# EAGLE schematic Circuit (EAGLE 7.5.0)
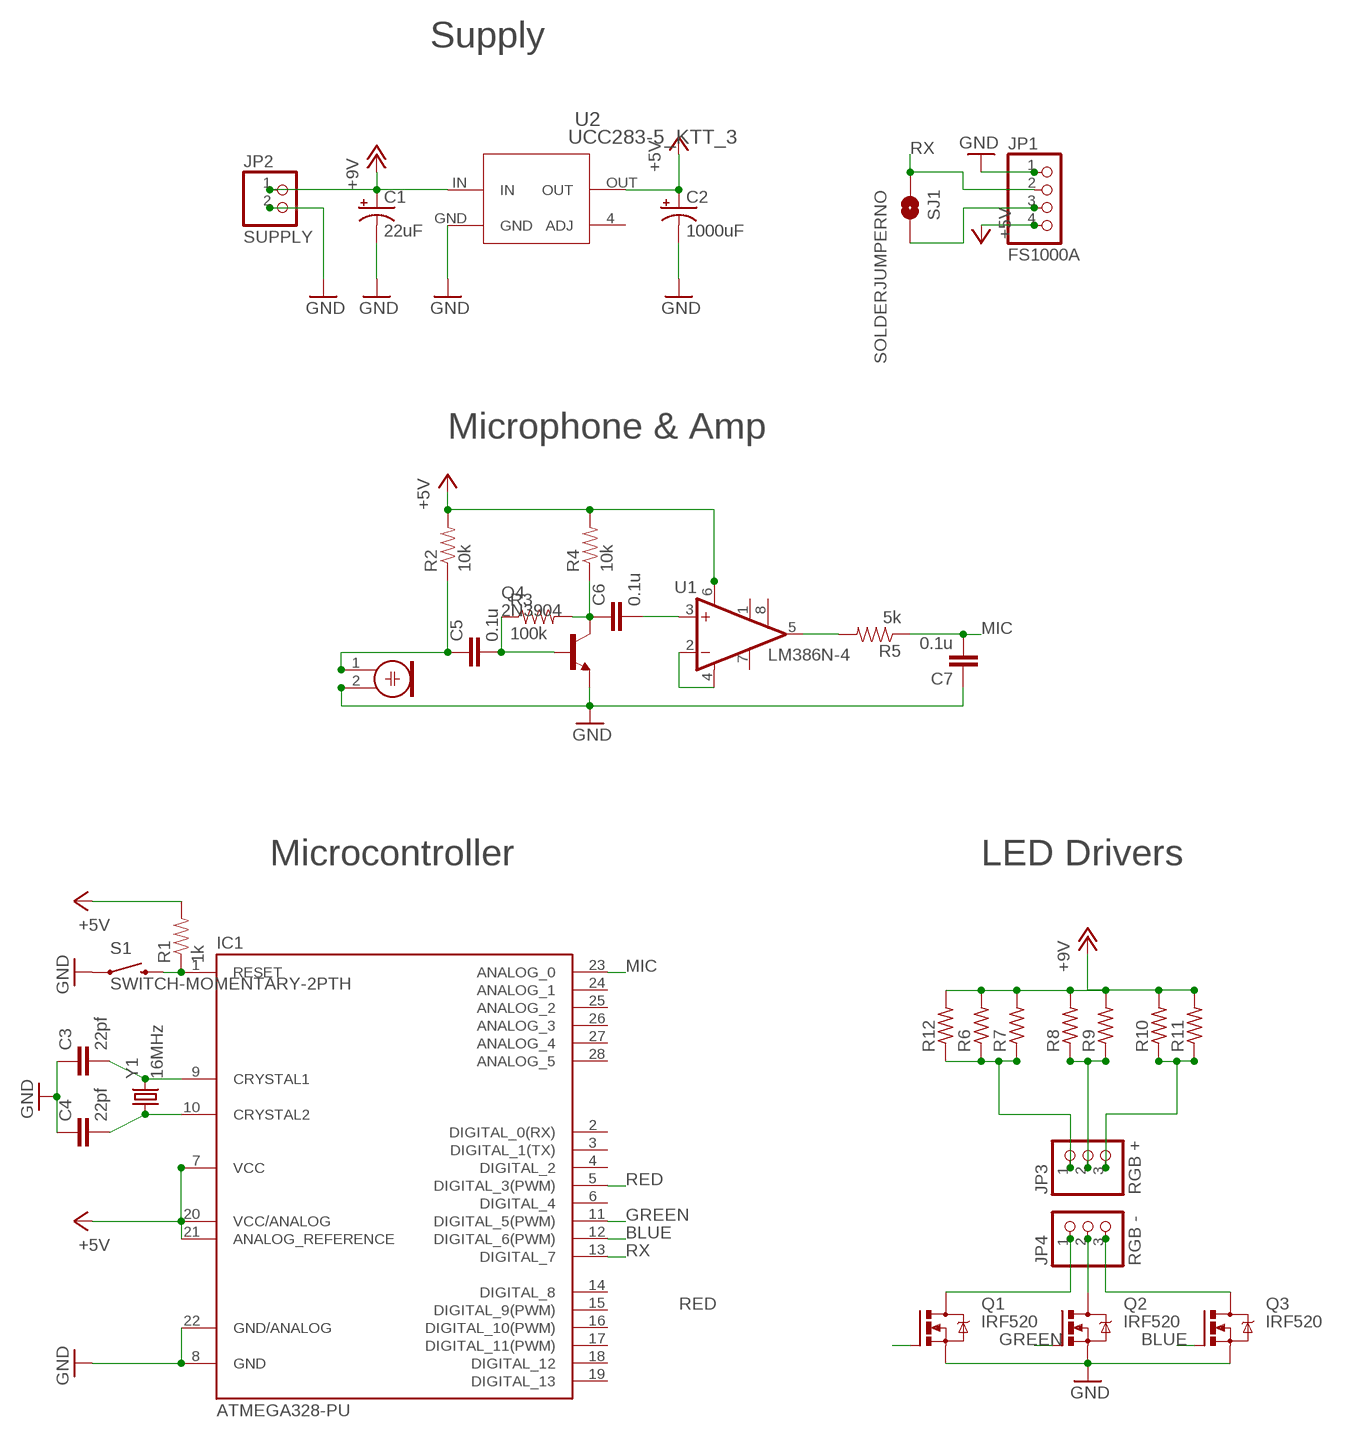
[diagram p0: schematic, sheet 1]

## Parts
C1  22uF  CAP_POLPTH2  [CPOL-RADIAL-10UF-25V]
C2  1000uF  CAP_POLPTH4  [CPOL-RADIAL-1000UF-25V]
C3  22pf  CAPKIT  [CAP-PTH-SMALL-KIT]
C4  22pf  CAPKIT  [CAP-PTH-SMALL-KIT]
C5  0.1u  CAPPTH1  [CAP-PTH-5MM]
C6  0.1u  CAPPTH1  [CAP-PTH-5MM]
C7  0.1u  CAPPTH1  [CAP-PTH-5MM]
IC1  ATMEGA328-PU  ATMEGA168-PU  [DIL28-3]
JP1  FS1000A  PINHD-1X4  [1X04]
JP2  SUPPLY  PINHD-1X2  [1X02]
JP3  RGB +  PINHD-1X3  [1X03]
JP4  RGB -  PINHD-1X3  [1X03]
M1  MIC  ELECTRET_MICROPHON-WM-62PC/62PK  [WM-62PC/62PK]
Q1  IRF520  [TO220BV]
Q2  IRF520  [TO220BV]
Q3  IRF520  [TO220BV]
Q4  2N3904  [TO92]
R1  1k  RESISTOREZ  [AXIAL-0.3EZ]
R2  10k  RESISTOREZ  [AXIAL-0.3EZ]
R3  100k  RESISTOREZ  [AXIAL-0.3EZ]
R4  10k  RESISTOREZ  [AXIAL-0.3EZ]
R5  5k  RESISTOREZ  [AXIAL-0.3EZ]
R6  R-US_0613/5V  [P0613V]
R7  R-US_0613/5V  [P0613V]
R8  R-US_0613/5V  [P0613V]
R9  R-US_0613/5V  [P0613V]
R10  R-US_0613/5V  [P0613V]
R11  R-US_0613/5V  [P0613V]
R12  R-US_0613/5V  [P0613V]
S1  SWITCH-MOMENTARY-2PTH  [TACTILE-PTH]
SJ1  SOLDERJUMPERNO  [SJ_2S-NO]
U1  LM386N-4  [DIL08]
U2  UCC283-5_KTT_3  [KTT3_6P22X6P6]
Y1  16MHz  CRYSTALHC49US  [HC49US]

## Nets
+5V: C2.1(+) IC1.7(VCC) IC1.20(VCC/ANALOG) IC1.21(ANALOG_REFERENCE) JP1.4 R1.P$2 R2.P$2 R4.P$2 U1.6(VS) U2.OUT
+12V: C1.1(+) JP2.1 R6.2 R7.2 R8.2 R9.2 R10.2 R11.2 R12.2 U2.IN ; supply symbol labelled +9V
BLUE: IC1.12(DIGITAL_6(PWM)) Q3.G
GND: C1.2(-) C2.2(-) C3.1 C4.1 C7.1 IC1.8(GND) IC1.22(GND/ANALOG) JP1.1 JP2.2 M1.2 Q1.S Q2.S Q3.S Q4.3(E) S1.1 U2.GND
GREEN: IC1.11(DIGITAL_5(PWM)) Q2.G
MIC: C7.2 IC1.23(ANALOG_0) R5.P$1
N$1: JP1.3 SJ1.2
N$2: C3.2 IC1.9(CRYSTAL1) Y1.2
N$3: C4.2 IC1.10(CRYSTAL2) Y1.1
N$4: IC1.1(RESET) R1.P$1 S1.3
N$5: JP4.1 Q1.D
N$6: JP4.2 Q2.D
N$7: JP4.3 Q3.D
N$8: C5.2 Q4.2(B) R3.P$1
N$9: C5.1 M1.1 R2.P$1
N$11: C6.1 Q4.1(C) R3.P$2 R4.P$1
N$12: R5.P$2 U1.5(OUT)
N$15: U1.2(-IN) U1.4(GND)
N$16: JP3.1 R6.1 R7.1 R12.1
N$17: JP3.2 R8.1 R9.1
N$18: JP3.3 R10.1 R11.1
N$19: C6.2 U1.3(+IN)
RED: IC1.5(DIGITAL_3(PWM)) Q1.G
RX: IC1.13(DIGITAL_7) JP1.2 SJ1.1
Unconnected: IC1.2(DIGITAL_0(RX)) IC1.3(DIGITAL_1(TX)) IC1.4(DIGITAL_2) IC1.6(DIGITAL_4) IC1.14(DIGITAL_8) IC1.15(DIGITAL_9(PWM)) IC1.16(DIGITAL_10(PWM)) IC1.17(DIGITAL_11(PWM)) IC1.18(DIGITAL_12) IC1.19(DIGITAL_13) IC1.24(ANALOG_1) IC1.25(ANALOG_2) IC1.26(ANALOG_3) IC1.27(ANALOG_4) IC1.28(ANALOG_5) U1.1(GAIN) U1.7(BYPASS) U1.8(GAIN) U2.4(ADJ)

## Notes on the sheet
- Supply
- Microphone & Amp
- Microcontroller | LED Drivers

## Library data of the parts
C1 C2 = SparkFun-Capacitors:CAP_POL: Capacitor Polarized These are standard SMD and PTH capacitors. Normally 10uF, 47uF, and 100uF in electrolytic and tantalum varieties. Always verify the external diameter of the through hole cap, it varies with capacity, voltage, and manufacturer. The EIA devices should be standard.
C3-C7 = SparkFun-Capacitors:CAP: Capacitor Standard 0603 ceramic capacitor, and 0.1" leaded capacitor.
IC1 = Arduino-AVR:ATMEGA168-PU
JP1 = pinhead:PINHD-1X4: PIN HEADER
JP2 = pinhead:PINHD-1X2: PIN HEADER
JP3 JP4 = pinhead:PINHD-1X3: PIN HEADER
M1 = microphon:ELECTRET_MICROPHON-: Electret Condenser Microphone
Q1-Q3 = transistor-power:IRF520: HEXFET Power MOSFET
Q4 = transistor-npn:2N3904: NPN Transistor
R1-R5 = SparkFun-Resistors:RESISTOR: Resistor Basic schematic elements and footprints for 0603, 1206, and PTH resistors.
R6-R12 = resistor:R-US_: RESISTOR, American symbol
S1 = SparkFun-Electromechanical:SWITCH-MOMENTARY-2: Various NO switches- pushbuttons, reed, etc
SJ1 = SparkFun-Passives:SOLDERJUMPER: Solder Jumper Standard SMD solder jumper. Used to automate production. Two varients : Normally Open and Normally Closed are the same, but have different paste layers. NC will have a large amount of paste and should jumper during reflow.
U1 = linear:LM386?-*: Low Voltage Audio Power Amplifier Source: http://cache.national.com/ds/LM/LM386.pdf
U2 = UCC283-5:UCC283-5_KTT_3; DATASHEETURL: http://www.ti.com/lit/gpn/UCC283-5; DESCRIPTION: Single Output LDO, 3.0A, Fixed(5.0V), Reverse Current Protection, Thermal Shutdown; FAMILY_NAME: SINGLE CHANNEL LDO; GENERIC_PART_NUMBER: UCC283-5; INDUSTRY_STD_PKG_TYPE: DDPAK/TO-263; MANUFACTURER: Texas Instruments; MANUFACTURER_PART_NUMBER: ucc283-5_ktt_3; PACKAGE_DESIGNATOR: KTT; PIN_COUNT: 3; VENDOR: Texas Instruments
Y1 = SparkFun-FreqCtrl:CRYSTAL: Various standard crystals. Proven footprints. Spark Fun Electronics SKU : COM-00534